# Altium schematic sheet CurrentSensor.SchDoc
size A
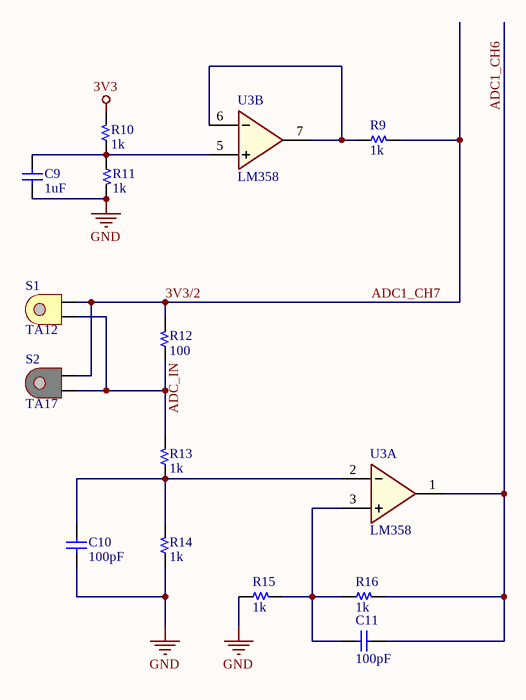
[diagram p0: CurrentSensor.SchDoc]

## Parts
C9  1uF  [C 0805]
C10  100pF  [C 0805]
C11  100pF  [C 0805]
R9  1k  [R 0805]
R10  1k  [R 0805]
R11  1k  [R 0805]
R12  100  [R 0805]
R13  1k  [R 0805]
R14  1k  [R 0805]
R15  1k  [R 0805]
R16  1k  [R 0805]
S1  TA12  [TA12]
S2  TA17  [TA17]
U3  LM358  [SOIC-8]  (parts A,B of 2)

## Nets
3V3: R10.2
GND: C9.1 C10.2 R11.2 R14.1 R15.1 U3.4(GND)
VCC: U3.8(VCC)
3V3/2: R9.2 R12.2 S1.2 S2.2  [also labelled ADC1_CH7]
ADC1_CH6: C11.2 R16.2 U3.1(OutA)
ADC_IN: R12.1 R13.2 S1.1 S2.1
NetC9_2: C9.2 R10.1 R11.1 U3.5(B+)
NetC10_1: C10.1 R13.1 R14.2 U3.2(A-)
NetC11_1: C11.1 R15.2 R16.1 U3.3(A+)
NetR9_1: R9.1 U3.6(B-) U3.7(OutB)

## Library data of the parts
C9-C11 = Capacitor NP: Capacitor non-pol
R9-R16 = Resistor
U3 = LM358: Low Power Dual Operational Amplifiers